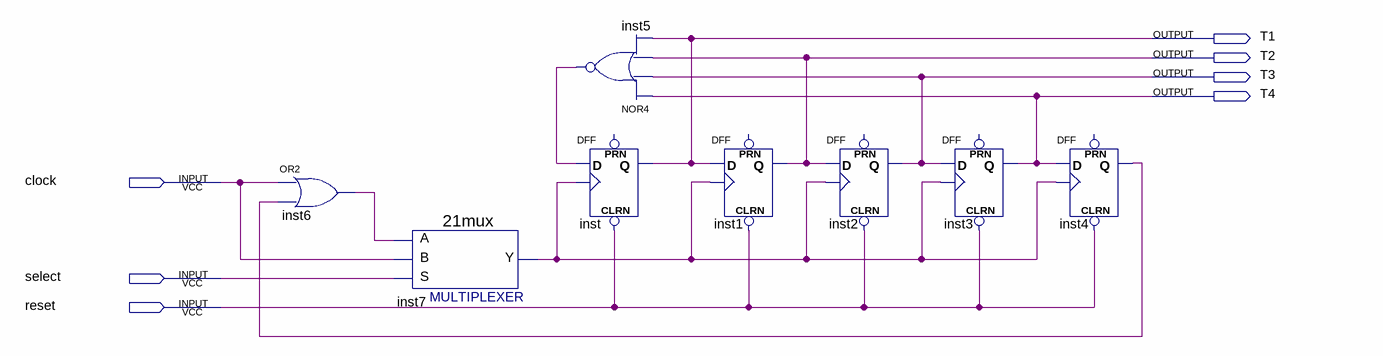
[diagram p0: schematic sheet]
// Quartus schematic Chapter3-3.bdf as structural Verilog: 8 symbols, 7 pins
module \Chapter3-3  (
  input  clock,
  input  select,
  input  reset,
  output T1,
  output T2,
  output T3,
  output T4
);

  wire inst4_q, inst5_out, inst6_out, inst7_y;

  or inst6 (inst6_out, clock, inst4_q);
  \21mux  inst7 (.S(select), .B(clock), .A(inst6_out), .Y(inst7_y));
  nor inst5 (inst5_out, T4, T3, T2, T1);
  DFF inst (.CLRN(reset), .CLK(inst7_y), .D(inst5_out), .Q(T1));  // open: PRN
  DFF inst1 (.CLRN(reset), .CLK(inst7_y), .D(T1), .Q(T2));  // open: PRN
  DFF inst2 (.CLRN(reset), .CLK(inst7_y), .D(T2), .Q(T3));  // open: PRN
  DFF inst3 (.CLRN(reset), .CLK(inst7_y), .D(T3), .Q(T4));  // open: PRN
  DFF inst4 (.CLRN(reset), .CLK(inst7_y), .D(T4), .Q(inst4_q));  // open: PRN
endmodule
